# EasyEDA schematic SmartBin.json
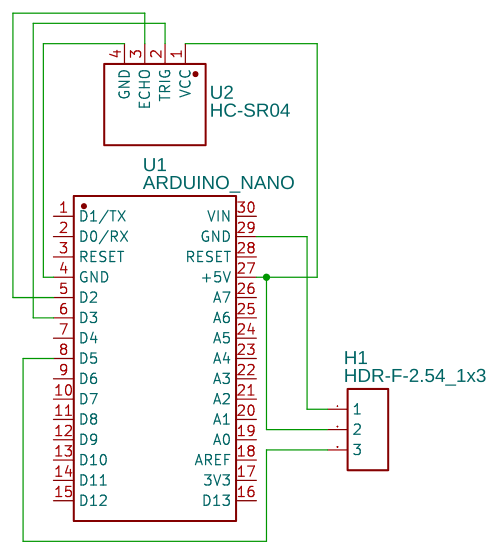
[diagram p0: schematic sheet]

## Parts
H1  HDR-F-2.54_1x3  [HDR-F-2.54_1X3]
U1  ARDUINO_NANO  [COMM-TH_ARDUINO_NANO]
U2  HC-SR04  [TH_HC-SR04V]

## Library data of the parts
H1 = HDR-F-2.54_1x3: Supplier Part: C146690; Supplier: LCSC; Contributor: LCEDA_Lib
U1 = ARDUINO_NANO: Contributor: lcsc; Supplier: LCSC; Supplier Part: C9900017879; Manufacturer: null; JLCPCB Part Class: Extended Part
U2 = HC-SR04: Supplier: LCSC; Supplier Part: C19857336; Manufacturer: Universal Microelectronics; Contributor: lcsc; JLCPCB Part Class: Extended Part

## Nets
Net-(H1-1): H1.1 U1.29(GND)
Net-(H1-2): H1.2 U1.27(+5V) U2.1(VCC)
Net-(H1-3): H1.3 U1.8(D5)
Net-(U1-4): U1.4(GND) U2.4(GND)
Net-(U1-5): U1.5(D2) U2.3(ECHO)
Net-(U1-6): U1.6(D3) U2.2(TRIG)

Not connected (* = marked no-connect by the designer): U1 1(D1/TX) 2(D0/RX) 3(RESET) 7(D4) 9(D6) 10(D7) 11(D8) 12(D9) 13(D10) 14(D11) 15(D12) 16(D13) 17(3V3) 18(AREF) 19(A0) 20(A1) 21(A2) 22(A3) 23(A4) 24(A5) 25(A6) 26(A7) 28(RESET) 30(VIN)
